# Altium schematic sheet Temperature_Sense.SchDoc
size A4; Organization: TESLA Motors, INC; Address1: 3500 Deer Creek Road; Address2: Palo Alto, CA; Address4: U.S.A.; SheetNumber: 6; SheetTotal: 8
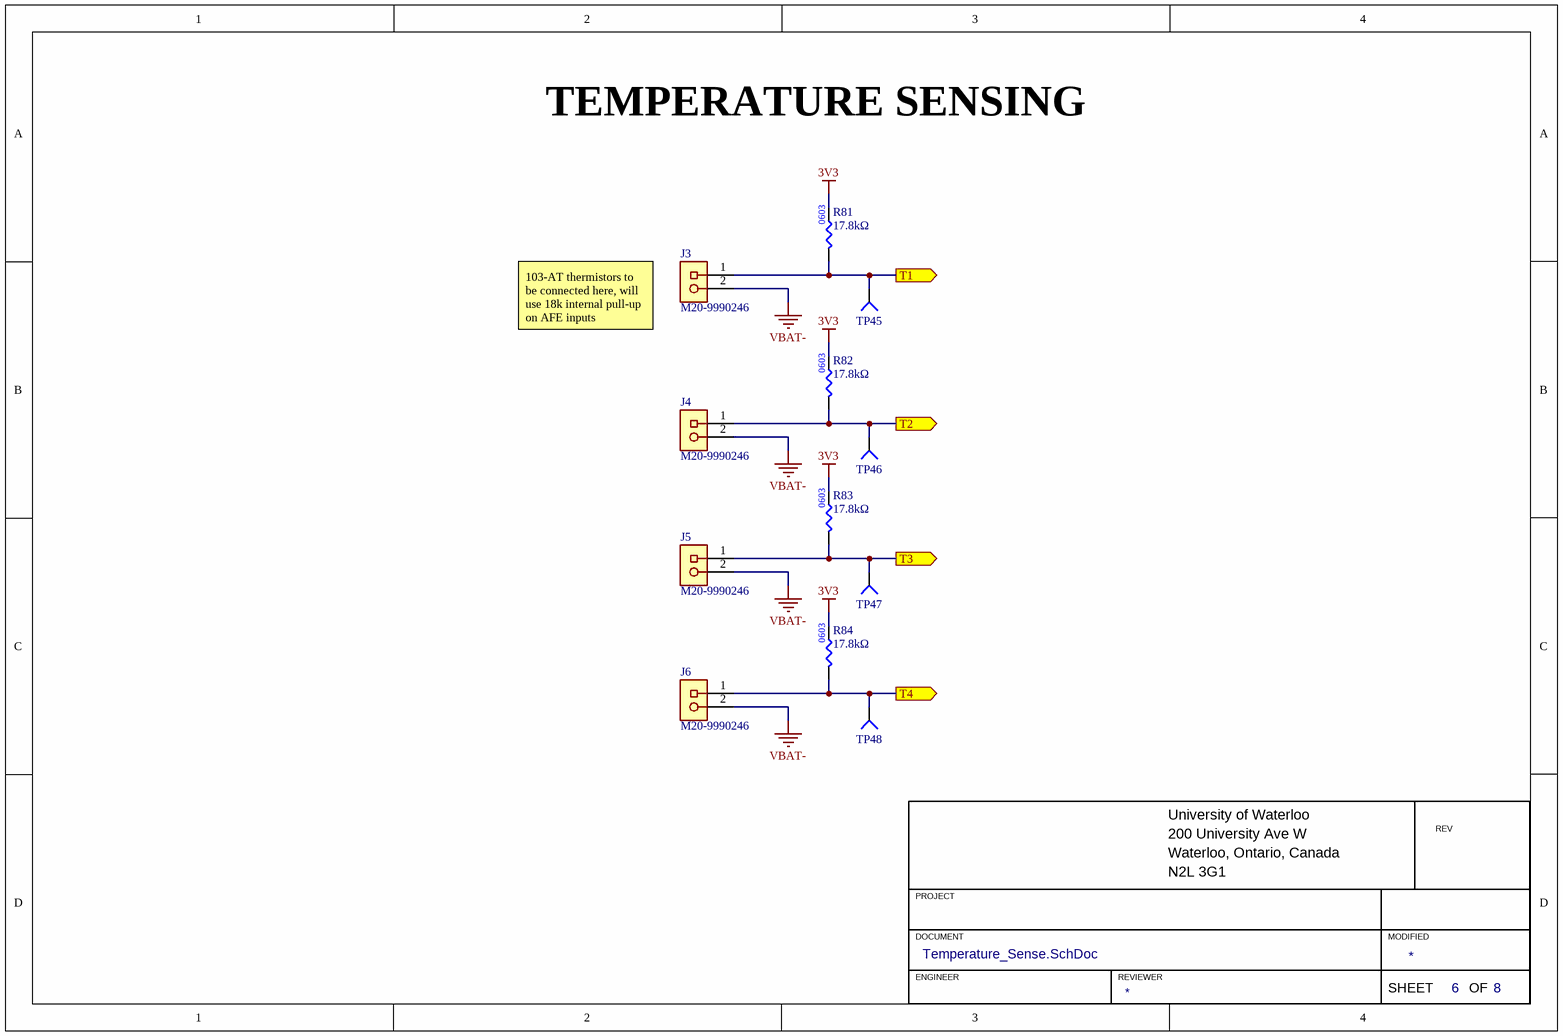
[diagram p0: Temperature_Sense.SchDoc]

## Parts
J3  Manufacturer Part Number 1: M20-9990246  [HDR1X2]  (hidden comment: HEADER 2x1)
J4  Manufacturer Part Number 1: M20-9990246  [HDR1X2]  (hidden comment: HEADER 2x1)
J5  Manufacturer Part Number 1: M20-9990246  [HDR1X2]  (hidden comment: HEADER 2x1)
J6  Manufacturer Part Number 1: M20-9990246  [HDR1X2]  (hidden comment: HEADER 2x1)
R81  value 17.8kΩ  [RES0603]  (hidden comment: RES_17.8kΩ_0603_1%)
R82  value 17.8kΩ  [RES0603]  (hidden comment: RES_17.8kΩ_0603_1%)
R83  value 17.8kΩ  [RES0603]  (hidden comment: RES_17.8kΩ_0603_1%)
R84  value 17.8kΩ  [RES0603]  (hidden comment: RES_17.8kΩ_0603_1%)
TP45  TESTPOINT_1MM_CIRCLE  [TESTPOINT_CIRCLE_1MM]  (value not drawn)  (no BOM)
TP46  TESTPOINT_1MM_CIRCLE  [TESTPOINT_CIRCLE_1MM]  (value not drawn)  (no BOM)
TP47  TESTPOINT_1MM_CIRCLE  [TESTPOINT_CIRCLE_1MM]  (value not drawn)  (no BOM)
TP48  TESTPOINT_1MM_CIRCLE  [TESTPOINT_CIRCLE_1MM]  (value not drawn)  (no BOM)

## Ports
T1 (out), T2 (out), T3 (out), T4 (out)

## Nets
3V3: R81.2 R82.2 R83.2 R84.2
VBAT-: J3.2 J4.2 J5.2 J6.2
T1: J3.1(VCC) R81.1 TP45.1(=value) ; port T1
T2: J4.1(VCC) R82.1 TP46.1(=value) ; port T2
T3: J5.1(VCC) R83.1 TP47.1(=value) ; port T3
T4: J6.1(VCC) R84.1 TP48.1(=value) ; port T4

## Notes on the sheet
- TEMPERATURE SENSING
- 103-AT thermistors to be connected here, will use 18k internal pull-up on AFE inputs
- University of Waterloo
- 200 University Ave W
- REV
- PROJECT
- Waterloo, Ontario, Canada
- N2L 3G1
- DOCUMENT
- ENGINEER
- REVIEWER
- MODIFIED
- SHEET
- OF
- (in symbol RES_17.8kΩ_0603_1%) 0603

## Library data of the parts
J3-J6 = HEADER 2x1: Manufacturer 1: Harwin Inc.; Package/Footprint: TH; Mounting Type: TH; Supplier 1: Digi-Key; Supplier Part Number 1: 952-2262-ND
R81-R84 = RES_17.8kΩ_0603_1%: RES 17.8K OHM 1% 1/10W 0603; Manufacturer 1: YAGEO; Manufacturer Part Number 1: RC0603FR-0717K8L; Supplier Part Number 1: 311-17.8KHRCT-ND; Supplier 1: Digi-Key
TP45-TP48 = TESTPOINT_1MM_CIRCLE: TESTPOINT 1MM CIRCLE